# Altium project stm32f405rgt.PrjPcb
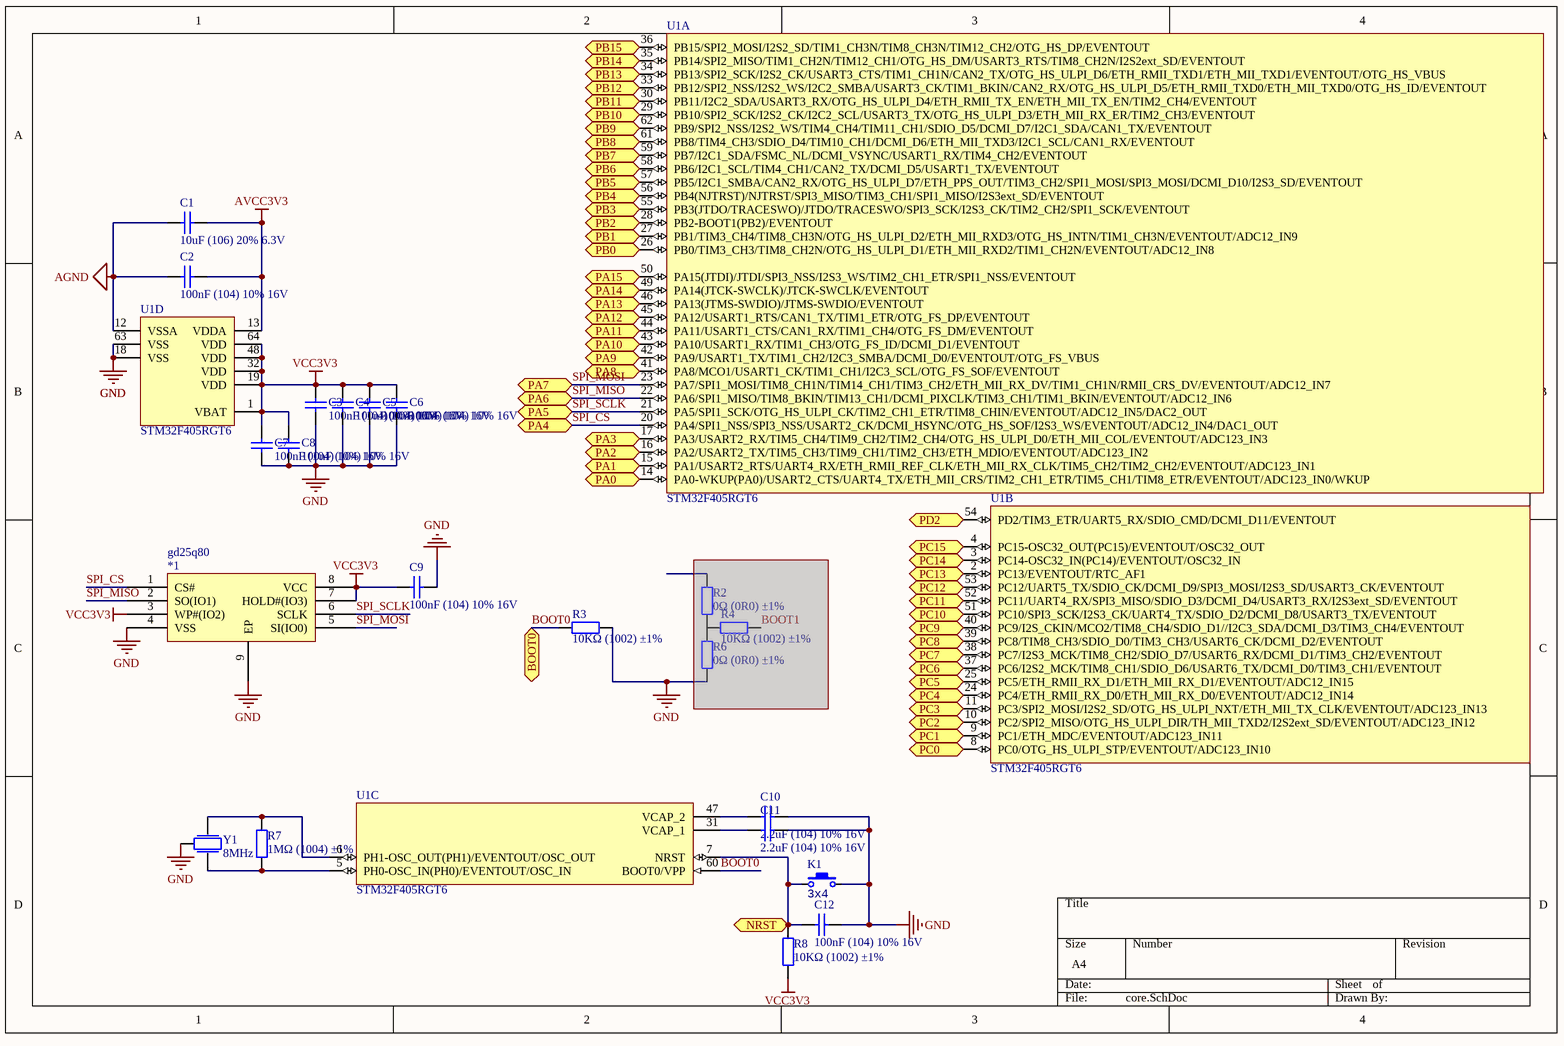
[diagram p0: core.SchDoc]
4 sheets, 84 parts. Net scope: flat (ports and power ports of the same name join across sheets).
Board files: PCB2.PcbDoc, PCB1.PcbDoc
Sheets:
  core.SchDoc
  storage.SchDoc
  power.SchDoc
  usb.SchDoc

## Sheet core.SchDoc
size A4; SheetNumber: 3; SheetTotal: 5

### Parts
(Parts that share a designator on the sheet are numbered #1, #2 ... from top to bottom, then left to right.)
*1  gd25q80  [USON-8]
C1  10uF (106) 20% 6.3V  [LC-0402_C]
C2  100nF (104) 10% 16V  [LC-0402_C]
C3  100nF (104) 10% 16V  [LC-0402_C]
C4  100nF (104) 10% 16V  [LC-0402_C]
C5  100nF (104) 10% 16V  [LC-0402_C]
C6  100nF (104) 10% 16V  [LC-0402_C]
C7  100nF (104) 10% 16V  [LC-0402_C]
C8  100nF (104) 10% 16V  [LC-0402_C]
C9  100nF (104) 10% 16V  [LC-0402_C]
C10  2.2uF (104) 10% 16V  [LC-0402_C]
C11  2.2uF (104) 10% 16V  [LC-0402_C]
C12#1  100nF (104) 10% 16V  [LC-0402_C]
K1  value 3x4  [ButtonTACT_3x4x2_180]  (hidden comment: TACT 2P)
R2  0Ω (0R0) ±1%  [LC-0402_R]  (masked out: inside a compile mask, not in the netlist)
R3  10KΩ (1002) ±1%  [LC-0402_R]
R4#1  10KΩ (1002) ±1%  [LC-0402_R]  (masked out: inside a compile mask, not in the netlist)
R6#1  0Ω (0R0) ±1%  [LC-0402_R]  (masked out: inside a compile mask, not in the netlist)
R7#1  1MΩ (1004) ±1%  [LC-0402_R]
R8#1  10KΩ (1002) ±1%  [LC-0402_R]
U1  STM32F405RGT6  [LC-LQFP-64_10x10x05P]  (parts A,B,C,D of 4)
Y1  8MHz  [晶振-3P]

### Ports
BOOT0 (bidir), NRST (bidir), PA0 (bidir), PA1 (bidir), PA2 (bidir), PA3 (bidir), PA4 (bidir), PA5 (bidir), PA6 (bidir), PA7 (bidir), PA8 (bidir), PA9 (bidir), PA10 (bidir), PA11 (bidir), PA12 (bidir), PA13 (bidir), PA14 (bidir), PA15 (bidir), PB0 (bidir), PB1 (bidir), PB2 (bidir), PB3 (bidir), PB4 (bidir), PB5 (bidir), PB6 (bidir), PB7 (bidir), PB8 (bidir), PB9 (bidir), PB10 (bidir), PB11 (bidir), PB12 (bidir), PB13 (bidir), PB14 (bidir), PB15 (bidir), PC0 (bidir), PC1 (bidir), PC2 (bidir), PC3 (bidir), PC4 (bidir), PC5 (bidir), PC6 (bidir), PC7 (bidir), PC8 (bidir), PC9 (bidir), PC10 (bidir), PC11 (bidir), PC12 (bidir), PC13 (bidir), PC14 (bidir), PC15 (bidir), PD2 (bidir)

### Nets
AGND: C1.1 C2.2 U1.12(VSSA)
AVCC3V3: C1.2 C2.1 U1.13(VDDA)
GND: *1.4(VSS) *1.9(EP) C3.1 C4.1 C5.1 C6.1 C7.1 C8.1 C9.1 C10.1 C11.1 C12#1.1 K1.2 R3.1 U1.18(VSS) U1.63(VSS) Y1.2
VCC3V3: *1.3(WP#(IO2)) *1.7(HOLD#(IO3)) *1.8(VCC) C3.2 C4.2 C5.2 C6.2 C7.2 C8.2 C9.2 R8#1.1 U1.1(VBAT) U1.19(VDD) U1.32(VDD) U1.48(VDD) U1.64(VDD)
BOOT0: R3.2 U1.60(BOOT0/VPP) ; port BOOT0
SPI_CS: *1.1(CS#) U1.20(PA4/SPI1_NSS/SPI3_NSS/USART2_CK/DCMI_HSYNC/OTG_HS_SOF/I2S3_WS/EVENTOUT/ADC12_IN4/DAC1_OUT) ; port PA4
SPI_MISO: *1.2(SO(IO1)) U1.22(PA6/SPI1_MISO/TIM8_BKIN/TIM13_CH1/DCMI_PIXCLK/TIM3_CH1/TIM1_BKIN/EVENTOUT/ADC12_IN6) ; port PA6
SPI_MOSI: *1.5(SI(IO0)) U1.23(PA7/SPI1_MOSI/TIM8_CH1N/TIM14_CH1/TIM3_CH2/ETH_MII_RX_DV/TIM1_CH1N/RMII_CRS_DV/EVENTOUT/ADC12_IN7) ; port PA7
SPI_SCLK: *1.6(SCLK) U1.21(PA5/SPI1_SCK/OTG_HS_ULPI_CK/TIM2_CH1_ETR/TIM8_CHIN/EVENTOUT/ADC12_IN5/DAC2_OUT) ; port PA5
NetC10_2: C10.2 U1.47(VCAP_2)
NetC11_2: C11.2 U1.31(VCAP_1)
NetC12#1_2: C12#1.2 K1.1 R8#1.2 U1.7(NRST) ; port NRST
NetR7#1_1: R7#1.1 U1.5(PH0-OSC_IN(PH0)/EVENTOUT/OSC_IN) Y1.1
NetR7#1_2: R7#1.2 U1.6(PH1-OSC_OUT(PH1)/EVENTOUT/OSC_OUT) Y1.3
NetU1_2: U1.2(PC13/EVENTOUT/RTC_AF1) ; port PC13
NetU1_3: U1.3(PC14-OSC32_IN(PC14)/EVENTOUT/OSC32_IN) ; port PC14
NetU1_4: U1.4(PC15-OSC32_OUT(PC15)/EVENTOUT/OSC32_OUT) ; port PC15
NetU1_8: U1.8(PC0/OTG_HS_ULPI_STP/EVENTOUT/ADC123_IN10) ; port PC0
NetU1_9: U1.9(PC1/ETH_MDC/EVENTOUT/ADC123_IN11) ; port PC1
NetU1_10: U1.10(PC2/SPI2_MISO/OTG_HS_ULPI_DIR/TH_MII_TXD2/I2S2ext_SD/EVENTOUT/ADC123_IN12) ; port PC2
NetU1_11: U1.11(PC3/SPI2_MOSI/I2S2_SD/OTG_HS_ULPI_NXT/ETH_MII_TX_CLK/EVENTOUT/ADC123_IN13) ; port PC3
NetU1_14: U1.14(PA0-WKUP(PA0)/USART2_CTS/UART4_TX/ETH_MII_CRS/TIM2_CH1_ETR/TIM5_CH1/TIM8_ETR/EVENTOUT/ADC123_IN0/WKUP) ; port PA0
NetU1_15: U1.15(PA1/USART2_RTS/UART4_RX/ETH_RMII_REF_CLK/ETH_MII_RX_CLK/TIM5_CH2/TIM2_CH2/EVENTOUT/ADC123_IN1) ; port PA1
NetU1_16: U1.16(PA2/USART2_TX/TIM5_CH3/TIM9_CH1/TIM2_CH3/ETH_MDIO/EVENTOUT/ADC123_IN2) ; port PA2
NetU1_17: U1.17(PA3/USART2_RX/TIM5_CH4/TIM9_CH2/TIM2_CH4/OTG_HS_ULPI_D0/ETH_MII_COL/EVENTOUT/ADC123_IN3) ; port PA3
NetU1_24: U1.24(PC4/ETH_RMII_RX_D0/ETH_MII_RX_D0/EVENTOUT/ADC12_IN14) ; port PC4
NetU1_25: U1.25(PC5/ETH_RMII_RX_D1/ETH_MII_RX_D1/EVENTOUT/ADC12_IN15) ; port PC5
NetU1_26: U1.26(PB0/TIM3_CH3/TIM8_CH2N/OTG_HS_ULPI_D1/ETH_MII_RXD2/TIM1_CH2N/EVENTOUT/ADC12_IN8) ; port PB0
NetU1_27: U1.27(PB1/TIM3_CH4/TIM8_CH3N/OTG_HS_ULPI_D2/ETH_MII_RXD3/OTG_HS_INTN/TIM1_CH3N/EVENTOUT/ADC12_IN9) ; port PB1
NetU1_28: U1.28(PB2-BOOT1(PB2)/EVENTOUT) ; port PB2
NetU1_29: U1.29(PB10/SPI2_SCK/I2S2_CK/I2C2_SCL/USART3_TX/OTG_HS_ULPI_D3/ETH_MII_RX_ER/TIM2_CH3/EVENTOUT) ; port PB10
NetU1_30: U1.30(PB11/I2C2_SDA/USART3_RX/OTG_HS_ULPI_D4/ETH_RMII_TX_EN/ETH_MII_TX_EN/TIM2_CH4/EVENTOUT) ; port PB11
NetU1_33: U1.33(PB12/SPI2_NSS/I2S2_WS/I2C2_SMBA/USART3_CK/TIM1_BKIN/CAN2_RX/OTG_HS_ULPI_D5/ETH_RMII_TXD0/ETH_MII_TXD0/OTG_HS_ID/EVENTOUT) ; port PB12
NetU1_34: U1.34(PB13/SPI2_SCK/I2S2_CK/USART3_CTS/TIM1_CH1N/CAN2_TX/OTG_HS_ULPI_D6/ETH_RMII_TXD1/ETH_MII_TXD1/EVENTOUT/OTG_HS_VBUS) ; port PB13
NetU1_35: U1.35(PB14/SPI2_MISO/TIM1_CH2N/TIM12_CH1/OTG_HS_DM/USART3_RTS/TIM8_CH2N/I2S2ext_SD/EVENTOUT) ; port PB14
NetU1_36: U1.36(PB15/SPI2_MOSI/I2S2_SD/TIM1_CH3N/TIM8_CH3N/TIM12_CH2/OTG_HS_DP/EVENTOUT) ; port PB15
NetU1_37: U1.37(PC6/I2S2_MCK/TIM8_CH1/SDIO_D6/USART6_TX/DCMI_D0/TIM3_CH1/EVENTOUT) ; port PC6
NetU1_38: U1.38(PC7/I2S3_MCK/TIM8_CH2/SDIO_D7/USART6_RX/DCMI_D1/TIM3_CH2/EVENTOUT) ; port PC7
NetU1_39: U1.39(PC8/TIM8_CH3/SDIO_D0/TIM3_CH3/USART6_CK/DCMI_D2/EVENTOUT) ; port PC8
NetU1_40: U1.40(PC9/I2S_CKIN/MCO2/TIM8_CH4/SDIO_D1//I2C3_SDA/DCMI_D3/TIM3_CH4/EVENTOUT) ; port PC9
NetU1_41: U1.41(PA8/MCO1/USART1_CK/TIM1_CH1/I2C3_SCL/OTG_FS_SOF/EVENTOUT) ; port PA8
NetU1_42: U1.42(PA9/USART1_TX/TIM1_CH2/I2C3_SMBA/DCMI_D0/EVENTOUT/OTG_FS_VBUS) ; port PA9
NetU1_43: U1.43(PA10/USART1_RX/TIM1_CH3/OTG_FS_ID/DCMI_D1/EVENTOUT) ; port PA10
NetU1_44: U1.44(PA11/USART1_CTS/CAN1_RX/TIM1_CH4/OTG_FS_DM/EVENTOUT) ; port PA11
NetU1_45: U1.45(PA12/USART1_RTS/CAN1_TX/TIM1_ETR/OTG_FS_DP/EVENTOUT) ; port PA12
NetU1_46: U1.46(PA13(JTMS-SWDIO)/JTMS-SWDIO/EVENTOUT) ; port PA13
NetU1_49: U1.49(PA14(JTCK-SWCLK)/JTCK-SWCLK/EVENTOUT) ; port PA14
NetU1_50: U1.50(PA15(JTDI)/JTDI/SPI3_NSS/I2S3_WS/TIM2_CH1_ETR/SPI1_NSS/EVENTOUT) ; port PA15
NetU1_51: U1.51(PC10/SPI3_SCK/I2S3_CK/UART4_TX/SDIO_D2/DCMI_D8/USART3_TX/EVENTOUT) ; port PC10
NetU1_52: U1.52(PC11/UART4_RX/SPI3_MISO/SDIO_D3/DCMI_D4/USART3_RX/I2S3ext_SD/EVENTOUT) ; port PC11
NetU1_53: U1.53(PC12/UART5_TX/SDIO_CK/DCMI_D9/SPI3_MOSI/I2S3_SD/USART3_CK/EVENTOUT) ; port PC12
NetU1_54: U1.54(PD2/TIM3_ETR/UART5_RX/SDIO_CMD/DCMI_D11/EVENTOUT) ; port PD2
NetU1_55: U1.55(PB3(JTDO/TRACESWO)/JTDO/TRACESWO/SPI3_SCK/I2S3_CK/TIM2_CH2/SPI1_SCK/EVENTOUT) ; port PB3
NetU1_56: U1.56(PB4(NJTRST)/NJTRST/SPI3_MISO/TIM3_CH1/SPI1_MISO/I2S3ext_SD/EVENTOUT) ; port PB4
NetU1_57: U1.57(PB5/I2C1_SMBA/CAN2_RX/OTG_HS_ULPI_D7/ETH_PPS_OUT/TIM3_CH2/SPI1_MOSI/SPI3_MOSI/DCMI_D10/I2S3_SD/EVENTOUT) ; port PB5
NetU1_58: U1.58(PB6/I2C1_SCL/TIM4_CH1/CAN2_TX/DCMI_D5/USART1_TX/EVENTOUT) ; port PB6
NetU1_59: U1.59(PB7/I2C1_SDA/FSMC_NL/DCMI_VSYNC/USART1_RX/TIM4_CH2/EVENTOUT) ; port PB7
NetU1_61: U1.61(PB8/TIM4_CH3/SDIO_D4/TIM10_CH1/DCMI_D6/ETH_MII_TXD3/I2C1_SCL/CAN1_RX/EVENTOUT) ; port PB8
NetU1_62: U1.62(PB9/SPI2_NSS/I2S2_WS/TIM4_CH4/TIM11_CH1/SDIO_D5/DCMI_D7/I2C1_SDA/CAN1_TX/EVENTOUT) ; port PB9

### Library data of the parts
C1 = 0402 10uF (106) 20% 6.3V: 贴片电容; ComponentLink1Description: 供应商链接; ComponentLink1URL: http://www.szlcsc.com/product/details_16204.html; Package: 0402; Supplier: LC; SuppliersPartNumber: C15525
C2-C11 C12#1 = 0402 100nF (104) 10% 16V: 贴片电容; ComponentLink1Description: 供应商链接; ComponentLink1URL: http://www.szlcsc.com/product/details_1877.html; Package: 0402; Supplier: LC; SuppliersPartNumber: C1525
K1 = ButtonTACT_3x4x2_180: Button; type: TACT 2P
R2 R6#1 = 0402 0Ω (0R0) 1%: 贴片电阻; ComponentLink1Description: 供应商链接; ComponentLink1URL: http://www.szlcsc.com/product/details_17853.html; Package: 0402; Supplier: LC; SuppliersPartNumber: C17168
R3 R4#1 R8#1 = 0402 10KΩ (1002) 1%: 贴片电阻; ComponentLink1Description: 供应商链接; ComponentLink1URL: http://www.szlcsc.com/product/details_26487.html; Package: 0402; Supplier: LC; SuppliersPartNumber: C25744
R7#1 = 0402 1MΩ (1004) 1%: 贴片电阻; ComponentLink1Description: 供应商链接; ComponentLink1URL: http://www.szlcsc.com/product/details_26826.html; Package: 0402; Supplier: LC; SuppliersPartNumber: C26083
U1 = STM32F405RGT6: ARM; ComponentLink1Description: 供应商链接; ComponentLink1URL: http://www.szlcsc.com/product/details_16424.html; Package: LQFP-64_10x10x05P; Supplier: LC; SuppliersPartNumber: C15742
Y1 = 晶振-3Pin: 村田贴片

## Sheet storage.SchDoc
size A4; SheetNumber: 3; SheetTotal: 5
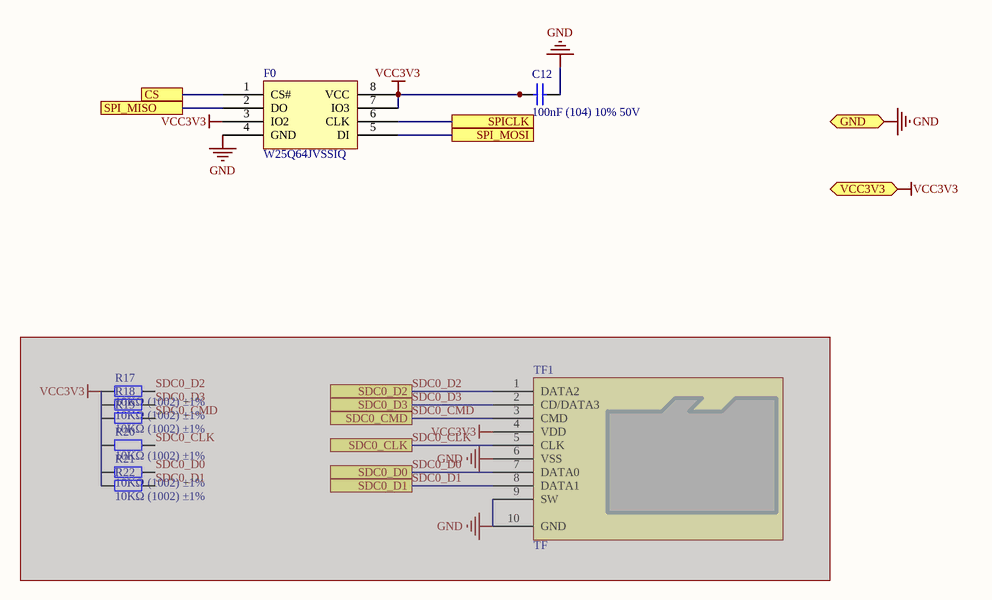
[diagram p1: storage.SchDoc]

### Parts
(Parts that share a designator on the sheet are numbered #1, #2 ... from top to bottom, then left to right.)
C12#2  100nF (104) 10% 50V  [LC-0603_C]
F0  W25Q64JVSSIQ  [W25Q64JVSSIQ]
R17  10KΩ (1002) ±1%  [LC-0402_R]  (masked out: inside a compile mask, not in the netlist)
R18  10KΩ (1002) ±1%  [LC-0402_R]  (masked out: inside a compile mask, not in the netlist)
R19  10KΩ (1002) ±1%  [LC-0402_R]  (masked out: inside a compile mask, not in the netlist)
R20  10KΩ (1002) ±1%  [LC-0402_R]  (masked out: inside a compile mask, not in the netlist)
R21  10KΩ (1002) ±1%  [LC-0402_R]  (masked out: inside a compile mask, not in the netlist)
R22  10KΩ (1002) ±1%  [LC-0402_R]  (masked out: inside a compile mask, not in the netlist)
TF1  TF  [TF-SOCKET]  (masked out: inside a compile mask, not in the netlist)

### Ports
CS, GND (bidir), SDC0_CLK, SDC0_CMD, SDC0_D0, SDC0_D1, SDC0_D2, SDC0_D3, SPI_MISO, SPI_MOSI, SPICLK, VCC3V3 (bidir)

### Nets
GND: C12#2.1 F0.4(GND) ; port GND
VCC3V3: C12#2.2 F0.3(IO2) F0.7(IO3) F0.8(VCC) ; port VCC3V3
NetF0_1: F0.1(CS#) ; port CS
NetF0_2: F0.2(DO) ; port SPI_MISO
NetF0_5: F0.5(DI) ; port SPI_MOSI
NetF0_6: F0.6(CLK) ; port SPICLK

### Library data of the parts
C12#2 = 0603 100nF (104) 10% 50V: 贴片电容; ComponentLink1Description: 供应商链接; ComponentLink1URL: http://www.szlcsc.com/product/details_15331.html; Package: 0603; Supplier: LC; SuppliersPartNumber: C14663
R17-R22 = 0402 10KΩ (1002) 1%: 贴片电阻; ComponentLink1Description: 供应商链接; ComponentLink1URL: http://www.szlcsc.com/product/details_26487.html; Package: 0402; Supplier: LC; SuppliersPartNumber: C25744
TF1 = TF卡座: 8脚自弹

## Sheet power.SchDoc
size A4; SheetNumber: 4; SheetTotal: 5
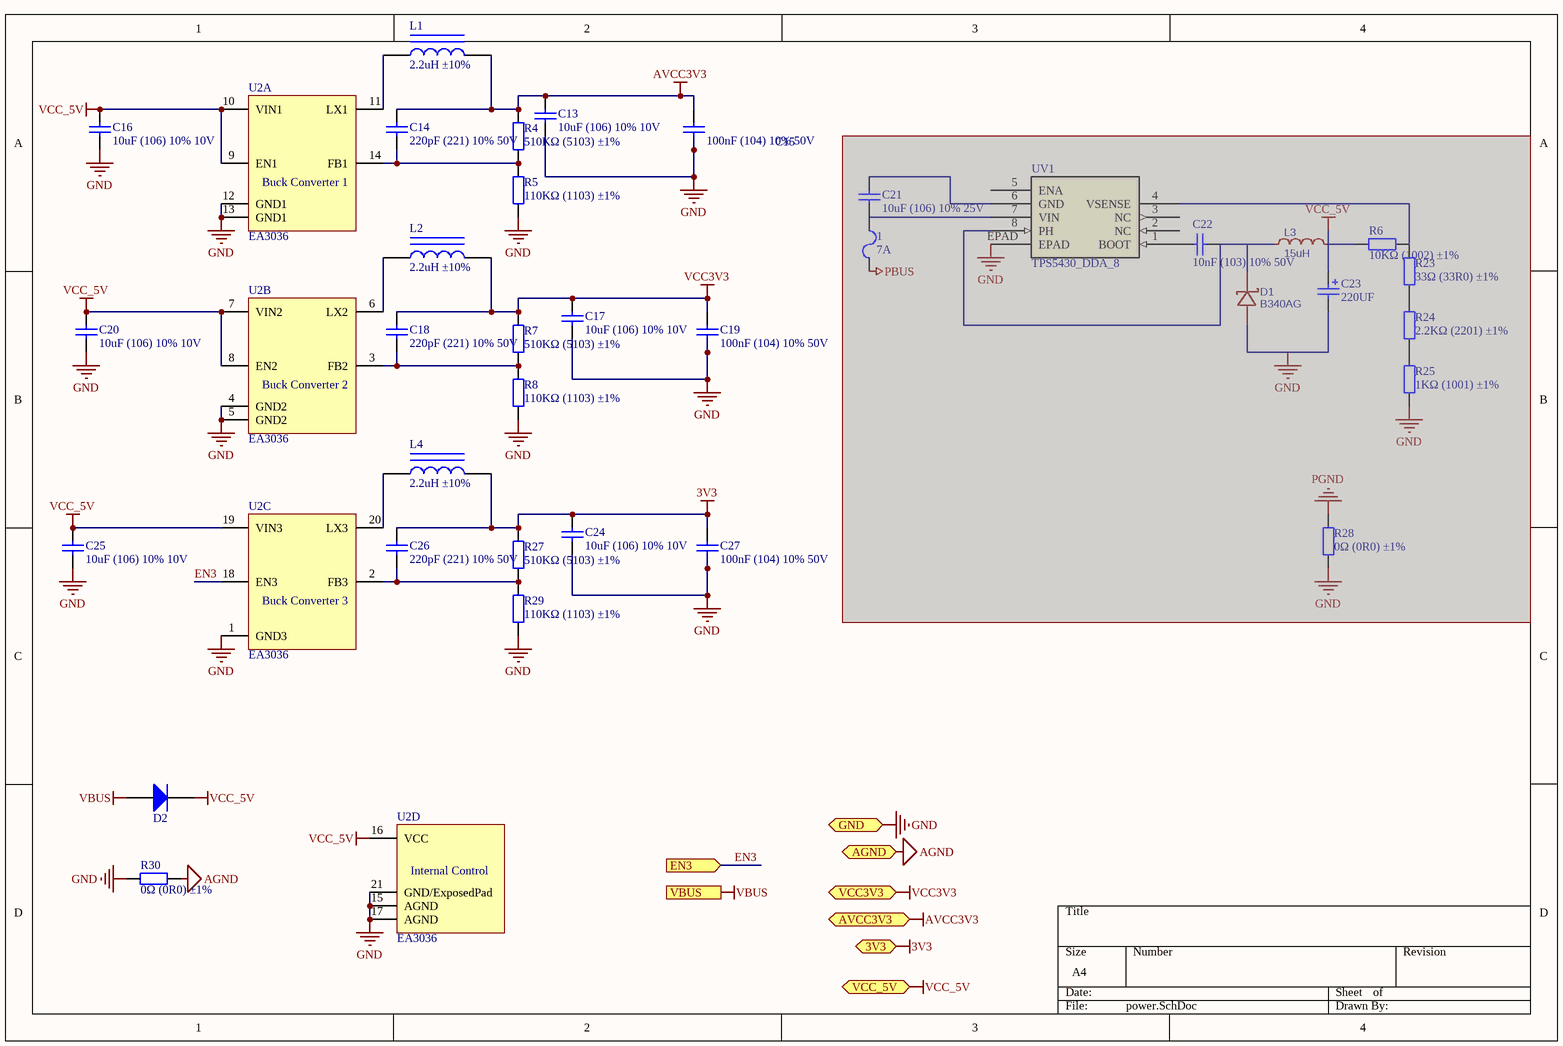
[diagram p2: power.SchDoc]

### Parts
(Parts that share a designator on the sheet are numbered #1, #2 ... from top to bottom, then left to right.)
1  7A  [2512]  (masked out: inside a compile mask, not in the netlist)
C13  10uF (106) 10% 10V  [LC-0603_C]
C14  220pF (221) 10% 50V  [LC-0603_C]
C15  100nF (104) 10% 50V  [LC-0603_C]
C16  10uF (106) 10% 10V  [LC-0603_C]
C17  10uF (106) 10% 10V  [LC-0603_C]
C18  220pF (221) 10% 50V  [LC-0603_C]
C19  100nF (104) 10% 50V  [LC-0603_C]
C20  10uF (106) 10% 10V  [LC-0603_C]
C21#1  10uF (106) 10% 25V  [LC-0805_C]  (masked out: inside a compile mask, not in the netlist)
C22  10nF (103) 10% 50V  [LC-0603_C]  (masked out: inside a compile mask, not in the netlist)
C23  220UF  [SMD,6.3x7.7mm]  (masked out: inside a compile mask, not in the netlist)
C24  10uF (106) 10% 10V  [LC-0603_C]
C25  10uF (106) 10% 10V  [LC-0603_C]
C26  220pF (221) 10% 50V  [LC-0603_C]
C27  100nF (104) 10% 50V  [LC-0603_C]
D1  B340AG  [SMA_L4.4-W2.6-LS5.0-RD]  (masked out: inside a compile mask, not in the netlist)
D2  二极管-5819W  [SOD-323]  (value not drawn)
L1  2.2uH ±10%  [LC-0805_L]
L2  2.2uH ±10%  [LC-0805_L]
L3  15uH  [电感]  (masked out: inside a compile mask, not in the netlist)
L4  2.2uH ±10%  [LC-0805_L]
R4#2  510KΩ (5103) ±1%  [LC-0603_R]
R5  110KΩ (1103) ±1%  [LC-0603_R]
R6#2  10KΩ (1002) ±1%  [LC-0805_R]  (masked out: inside a compile mask, not in the netlist)
R7#2  510KΩ (5103) ±1%  [LC-0603_R]
R8#2  110KΩ (1103) ±1%  [LC-0603_R]
R23  33Ω (33R0) ±1%  [LC-0805_R]  (masked out: inside a compile mask, not in the netlist)
R24  2.2KΩ (2201) ±1%  [LC-0805_R]  (masked out: inside a compile mask, not in the netlist)
R25  1KΩ (1001) ±1%  [LC-0805_R]  (masked out: inside a compile mask, not in the netlist)
R27  510KΩ (5103) ±1%  [LC-0603_R]
R28  0Ω (0R0) ±1%  [LC-0603_R]  (masked out: inside a compile mask, not in the netlist)
R29  110KΩ (1103) ±1%  [LC-0603_R]
R30  0Ω (0R0) ±1%  [LC-0603_R]
U2  EA3036  [QFN-20]  (parts A,B,C,D of 4)
UV1  TPS5430_DDA_8  [TPS5430]  (masked out: inside a compile mask, not in the netlist)

### Ports
3V3 (bidir), AGND (bidir), AVCC3V3 (bidir), EN3 (in), GND (bidir), VBUS (in), VCC3V3 (bidir), VCC_5V (bidir)

### Nets
3V3: C24.2 C26.2 C27.2 L4.2 R27.2 ; port 3V3
AGND: R30.1 ; port AGND
AVCC3V3: C13.2 C14.2 C15.2 L1.2 R4#2.2 ; port AVCC3V3
GND: C13.1 C15.1 C16.2 C17.1 C19.1 C20.2 C24.1 C25.2 C27.1 R5.1 R8#2.1 R29.1 R30.2 U2.1(GND3) U2.4(GND2) U2.5(GND2) U2.12(GND1) U2.13(GND1) U2.15(AGND) U2.17(AGND) U2.21(GND/ExposedPad) ; port GND
VBUS: D2.1(A) ; port VBUS
VCC3V3: C17.2 C18.2 C19.2 L2.2 R7#2.2 ; port VCC3V3
VCC_5V: C16.1 C20.1 C25.1 D2.2(K) U2.7(VIN2) U2.8(EN2) U2.9(EN1) U2.10(VIN1) U2.16(VCC) U2.19(VIN3) ; port VCC_5V
EN3: U2.18(EN3) ; port EN3
NetC14_1: C14.1 R4#2.1 R5.2 U2.14(FB1)
NetC18_1: C18.1 R7#2.1 R8#2.2 U2.3(FB2)
NetC26_1: C26.1 R27.1 R29.2 U2.2(FB3)
NetL1_1: L1.1 U2.11(LX1)
NetL2_1: L2.1 U2.6(LX2)
NetL4_1: L4.1 U2.20(LX3)

### Notes on the sheet
- (in symbol EA3036, part A) Buck Converter 1
- (in symbol EA3036, part B) Buck Converter 2
- (in symbol EA3036, part C) Buck Converter 3
- (in symbol EA3036, part D) Internal Control

### Library data of the parts
1 = Fuse
C13 C16 C17 C20 C24 C25 = 0603 10uF (106) 10% 10V: 贴片电容; ComponentLink1Description: 供应商链接; ComponentLink1URL: http://www.szlcsc.com/product/details_20411.html; Package: 0603; Supplier: LC; SuppliersPartNumber: C19702
C14 C18 C26 = 0603 220pF (221) 10% 50V: 贴片电容; ComponentLink1Description: 供应商链接; ComponentLink1URL: http://www.szlcsc.com/product/details_1955.html; Package: 0603; Supplier: LC; SuppliersPartNumber: C1603
C15 C19 C27 = 0603 100nF (104) 10% 50V: 贴片电容; ComponentLink1Description: 供应商链接; ComponentLink1URL: http://www.szlcsc.com/product/details_15331.html; Package: 0603; Supplier: LC; SuppliersPartNumber: C14663
C21#1 = 0805 10uF (106) 10% 25V: 贴片电容; ComponentLink1Description: 供应商链接; ComponentLink1URL: http://www.szlcsc.com/product/details_16532.html; Package: 0805; Supplier: LC; SuppliersPartNumber: C15850
C22 = 0603 10nF (103) 10% 50V: 贴片电容; ComponentLink1Description: 供应商链接; ComponentLink1URL: http://www.szlcsc.com/product/details_58143.html; Package: 0603; Supplier: LC; SuppliersPartNumber: C57112
C23 = C_RB-470UF/25V_5X10
D1 = B340AG: BOM_Manufacturer: Shikues; Contributor: LCSC; BOM_Supplier: LCSC; BOM_Supplier Part: C433997; BOM_Manufacturer Part: B340AG; BOM_JLCPCB Part Class: Extended Part; spicePre: D; spiceSymbolName: B340AG
D2 = 二极管-5819W: 40V
L1 L2 L4 = 0805 2.2uH 10%: 贴片电感; ComponentLink1Description: 供应商链接; ComponentLink1URL: http://www.szlcsc.com/product/details_1395.html; Package: 0805; Supplier: LC; SuppliersPartNumber: C1043
L3 = 15uH: BOM_Manufacturer: CENKER; BOM_Manufacturer Part: CKCS3012-15uH/M; nameAlias: Inductance; Contributor: LCSC; BOM_Supplier: LCSC; BOM_Supplier Part: C354559; BOM_JLCPCB Part Class: Extended Part; spicePre: L; spiceSymbolName: CKCS3012-15UH/M
R4#2 R7#2 R27 = 0603 510KΩ (5103) 1%: 贴片电阻; ComponentLink1Description: 供应商链接; ComponentLink1URL: http://www.szlcsc.com/product/details_23919.html; Package: 0603; Supplier: LC; SuppliersPartNumber: C23192
R5 R8#2 R29 = 0603 110KΩ (1103) 1%: 贴片电阻; ComponentLink1Description: 供应商链接; ComponentLink1URL: http://www.szlcsc.com/product/details_26548.html; Package: 0603; Supplier: LC; SuppliersPartNumber: C25805
R6#2 = 0805 10KΩ (1002) 1%: 贴片电阻; ComponentLink1Description: 供应商链接; ComponentLink1URL: http://www.szlcsc.com/product/details_18102.html; Package: 0805; Supplier: LC; SuppliersPartNumber: C17414
R23 = 0805 33Ω (33R0) 1%: 贴片电阻; ComponentLink1Description: 供应商链接; ComponentLink1URL: http://www.szlcsc.com/product/details_18322.html; Package: 0805; Supplier: LC; SuppliersPartNumber: C17634
R24 = 0805 2.2KΩ (2201) 1%: 贴片电阻; ComponentLink1Description: 供应商链接; ComponentLink1URL: http://www.szlcsc.com/product/details_18208.html; Package: 0805; Supplier: LC; SuppliersPartNumber: C17520
R25 = 0805 1KΩ (1001) 1%: 贴片电阻; ComponentLink1Description: 供应商链接; ComponentLink1URL: http://www.szlcsc.com/product/details_18201.html; Package: 0805; Supplier: LC; SuppliersPartNumber: C17513
R28 R30 = 0603 0Ω (0R0) 1%: 贴片电阻; ComponentLink1Description: 供应商链接; ComponentLink1URL: http://www.szlcsc.com/product/details_21903.html; Package: 0603; Supplier: LC; SuppliersPartNumber: C21189
U2 = EA3036: EA3036 is a 3CH power management IC for applications powered by one Li-Ion battery or a DC 5V adapter.
UV1 = TPS5430_DDA_8: Imported; Vendor: Texas Instruments; PACKAGE_DESIGNATOR: DDA; PIN_COUNT: 8; FAMILY_NAME: STEP-DOWN REGULATOR; INDUSTRY_STD_PKG_TYPE: SO PowerPAD; Manufacturer_Part_Number: tps5430_dda_8; GENERIC_PART_NUMBER: TPS5430; Manufacturer: Texas Instruments; Datasheet_URL: http://www.ti.com/lit/gpn/TPS5430; Value: Value; Type: Type; RefDes: RefDes

## Sheet usb.SchDoc
size A4; SheetNumber: 5; SheetTotal: 5
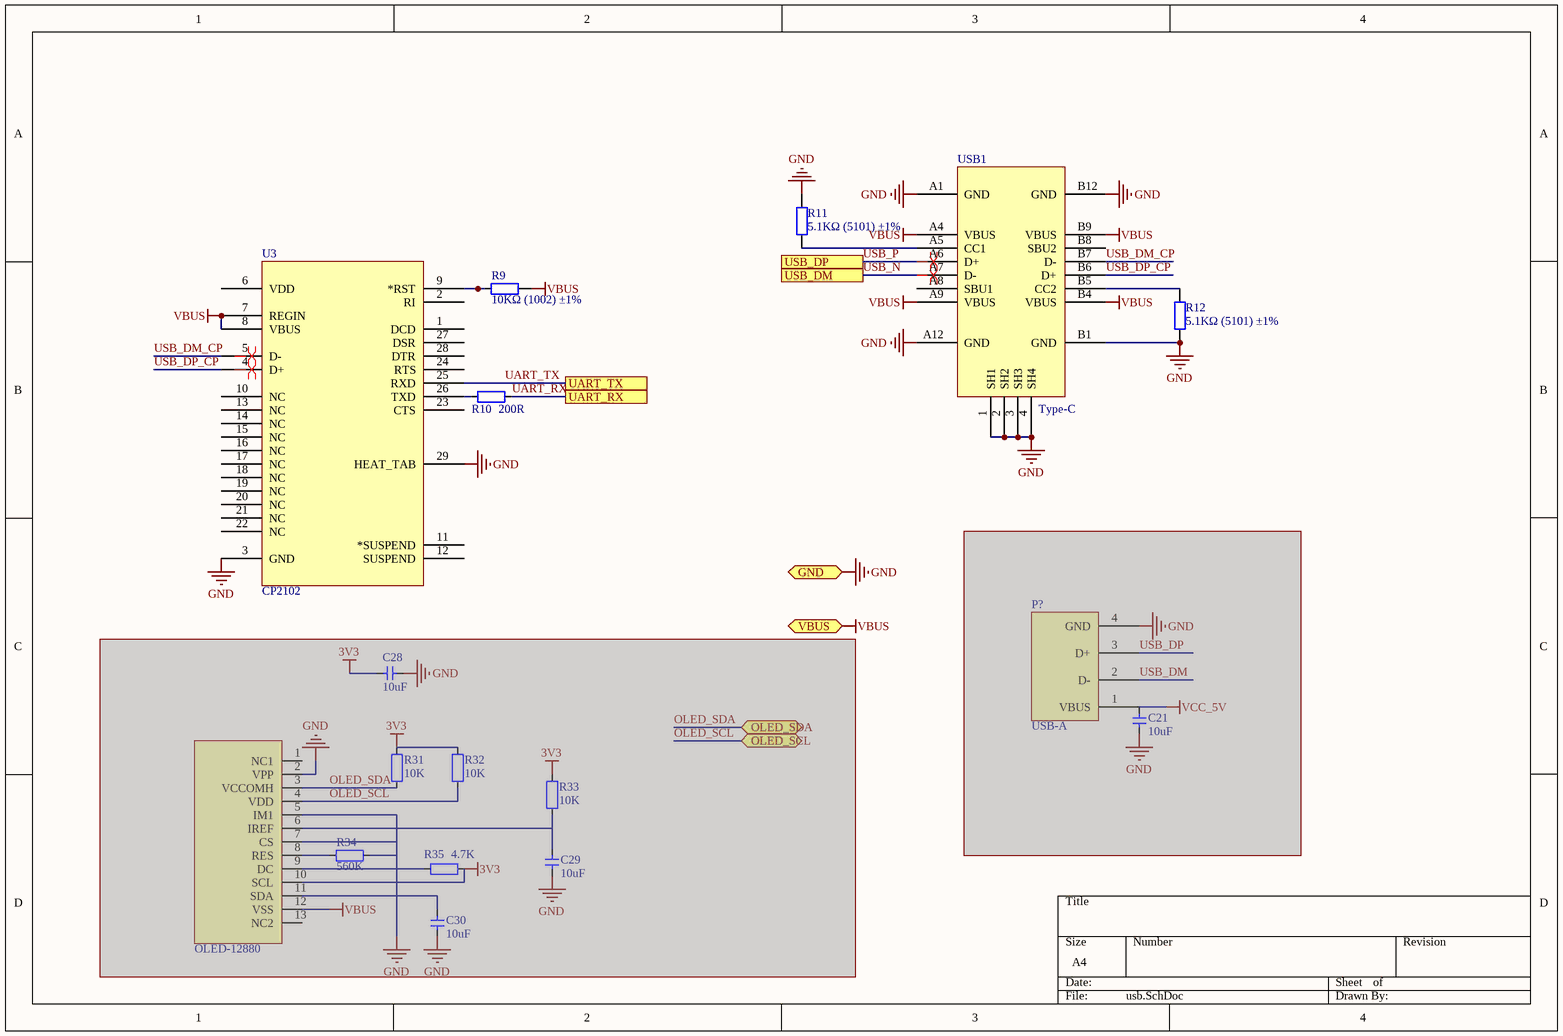
[diagram p3: usb.SchDoc]

### Parts
(Parts that share a designator on the sheet are numbered #1, #2 ... from top to bottom, then left to right.)
2  OLED-12880  [OLED-12880]  (masked out: inside a compile mask, not in the netlist)
C21#2  10uF  [CAP_0402]  (masked out: inside a compile mask, not in the netlist)
C28  10uF  [CAP_0402]  (masked out: inside a compile mask, not in the netlist)
C29  10uF  [CAP_0402]  (masked out: inside a compile mask, not in the netlist)
C30  10uF  [CAP_0402]  (masked out: inside a compile mask, not in the netlist)
P?  USB-A  [USB-Short]  (masked out: inside a compile mask, not in the netlist)
R9  10KΩ (1002) ±1%  [LC-0402_R]
R10  200R  [RES_0402]
R11  5.1KΩ (5101) ±1%  [LC-0402_R]
R12  5.1KΩ (5101) ±1%  [LC-0402_R]
R31  10K  [RES_0402]  (masked out: inside a compile mask, not in the netlist)
R32  10K  [RES_0402]  (masked out: inside a compile mask, not in the netlist)
R33  10K  [RES_0402]  (masked out: inside a compile mask, not in the netlist)
R34  560K  [RES_0402]  (masked out: inside a compile mask, not in the netlist)
R35  4.7K  [RES_0402]  (masked out: inside a compile mask, not in the netlist)
U3  CP2102  [QFN-28]
USB1  Type-C  [Type-C-TOP]

### Ports
GND (bidir), OLED_SCL (bidir), OLED_SDA (bidir), UART_RX, UART_TX, USB_DM, USB_DP, VBUS (bidir)

### Nets
GND: R11.1 R12.1 U3.3(GND) U3.29(HEAT_TAB) USB1.1(SH1) USB1.2(SH2) USB1.3(SH3) USB1.4(SH4) USB1.A1(GND) USB1.A12(GND) USB1.B1(GND) USB1.B12(GND) ; port GND
VBUS: R9.2 U3.7(REGIN) U3.8(VBUS) USB1.A4(VBUS) USB1.A9(VBUS) USB1.B4(VBUS) USB1.B9(VBUS) ; port VBUS
UART_RX: R10.1 ; port UART_RX
UART_TX: U3.25(RXD) ; port UART_TX
USB_DM_CP: U3.5(D-) USB1.B7(D-)
USB_DP_CP: U3.4(D+) USB1.B6(D+)
USB_N: USB1.A7(D-) ; port USB_DM
USB_P: USB1.A6(D+) ; port USB_DP
NetR9_1: R9.1 U3.9(*RST)
NetR10_2: R10.2 U3.26(TXD)
NetR11_2: R11.2 USB1.A5(CC1)
NetR12_2: R12.2 USB1.B5(CC2)

Not connected (* = marked no-connect by the designer): U3 1(DCD) 2(RI) 6(VDD) 10(NC) 11(*SUSPEND) 12(SUSPEND) 13(NC) 14(NC) 15(NC) 16(NC) 17(NC) 18(NC) 19(NC) 20(NC) 21(NC) 22(NC) 23(CTS) 24(RTS) 27(DSR) 28(DTR); USB1 A8(SBU1) B8(SBU2)

### Layout directives
differential pair: (no net found under the mark), USB_N, USB_P

### Library data of the parts
C21#2 C28-C30 = 电容-0402: Capacitor; Value: 0.1u
R9 = 0402 10KΩ (1002) 1%: 贴片电阻; ComponentLink1Description: 供应商链接; ComponentLink1URL: http://www.szlcsc.com/product/details_26487.html; Package: 0402; Supplier: LC; SuppliersPartNumber: C25744
R10 R31-R35 = 电阻-0402: Resistor; Value: 22R
R11 R12 = 0402 5.1KΩ (5101) 1%: 贴片电阻; ComponentLink1Description: 供应商链接; ComponentLink1URL: http://www.szlcsc.com/product/details_26648.html; Package: 0402; Supplier: LC; SuppliersPartNumber: C25905
U3 = CP2102: USB转TTL; PART DESC: SINGLE-CHIP USB TO UART BRIDGE, QFN28, RoHS.; MFG #1: SILICON LABS; PART NUMBER: CP2102; Value: Value; RefDes: RefDes; Type: DEV
USB1 = USB-Type-C-TOP

## Nets that join several sheets
AGND: core (C1.1 C2.2 U1.12), power (R30.1)
AVCC3V3: core (C1.2 C2.1 U1.13), power (5 pins)
GND: core (17 pins), storage (C12#2.1 F0.4), power (21 pins), usb (12 pins)
VBUS: power (D2.1), usb (7 pins)
VCC3V3: core (16 pins), storage (C12#2.2 F0.3 F0.7 F0.8), power (5 pins)